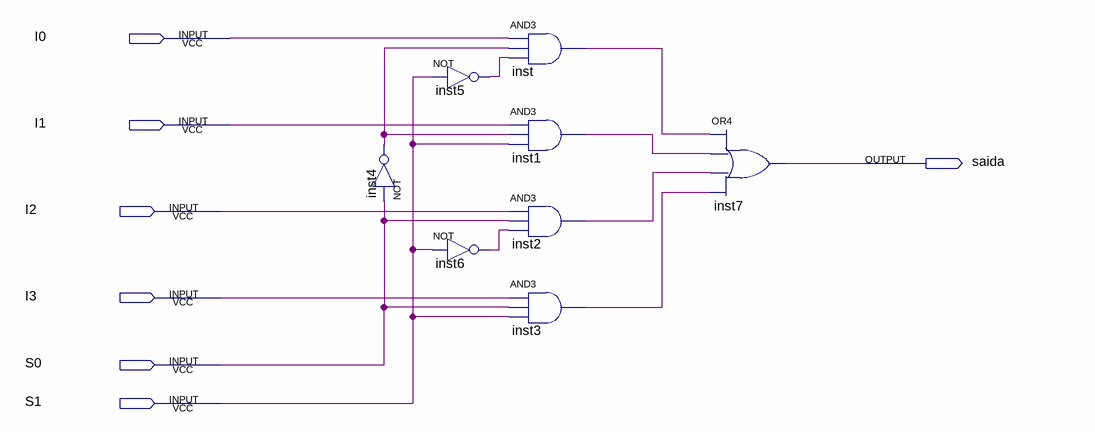
[diagram p0: schematic sheet]
// Quartus schematic MUX4.bdf as structural Verilog: 8 symbols, 7 pins
module MUX4 (
  input  I0,
  input  I1,
  input  I2,
  input  I3,
  input  S0,
  input  S1,
  output saida
);

  wire inst1_out, inst2_out, inst3_out, inst4_out, inst5_out, inst6_out, inst_out;

  not inst4 (inst4_out, S0);
  not inst5 (inst5_out, S1);
  not inst6 (inst6_out, S1);
  and inst (inst_out, I0, inst4_out, inst5_out);
  and inst1 (inst1_out, I1, inst4_out, S1);
  and inst2 (inst2_out, I2, S0, inst6_out);
  and inst3 (inst3_out, I3, S0, S1);
  or inst7 (saida, inst_out, inst1_out, inst2_out, inst3_out);
endmodule
